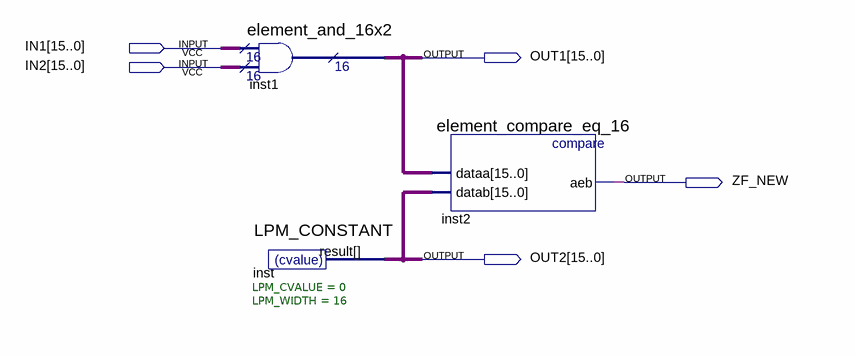
[diagram p0: schematic sheet]
// Quartus schematic block-operation-variant-and.bdf as structural Verilog: 3 symbols, 5 pins
module \block-operation-variant-and  (
  input  [15:0] IN1,
  input  [15:0] IN2,
  output [15:0] OUT1,
  output ZF_NEW,
  output [15:0] OUT2
);

  element_and_16x2 inst1 (.data0x(IN1), .data1x(IN2), .result(OUT1));
  LPM_CONSTANT #(.LPM_CVALUE(0), .LPM_WIDTH(16)) inst (.result(OUT2));
  element_compare_eq_16 inst2 (.dataa(OUT1), .datab(OUT2), .aeb(ZF_NEW));
endmodule
